# Altium schematic sheet MotorControl_Sch.SchDoc
size B
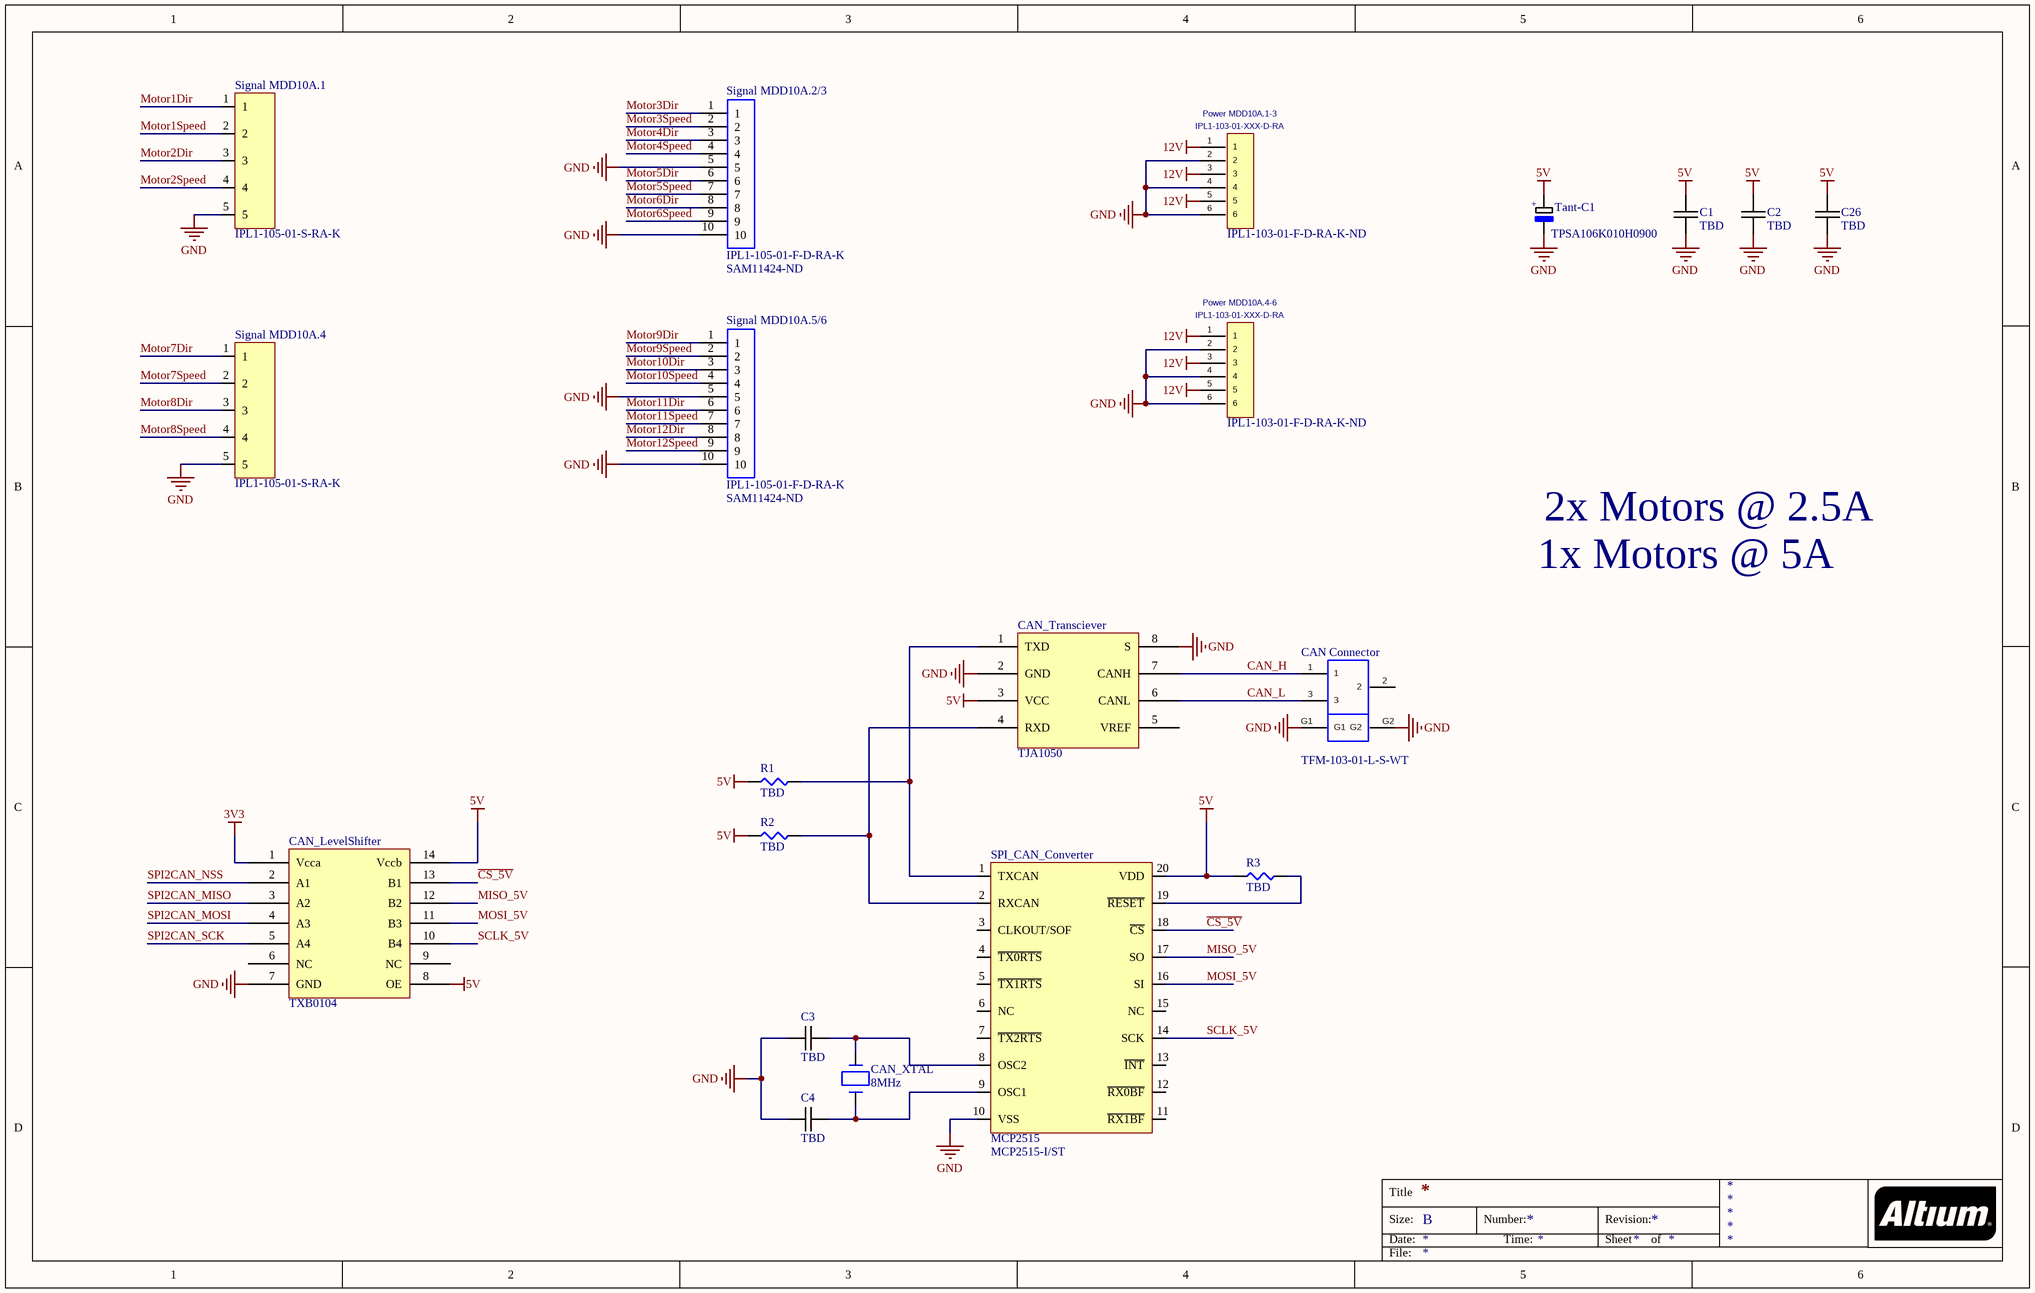
[diagram p0: MotorControl_Sch.SchDoc]

## Parts
C1  TBD  [0805C-GENERIC]
C2  TBD  [0805C-GENERIC]
C3  TBD  [0805C-GENERIC]
C4  TBD  [0805C-GENERIC]
C26  TBD  [0805C-GENERIC]
CAN_Connector  TFM-103-01-L-S-WT  [TFM-103-01-L-S-WT]
CAN_LevelShifter  TXB0104  [TXB0104]
CAN_Transciever  TJA1050  [TJA1050]
CAN_XTAL  8MHz  [GC0800044]
Power_MDD10A.1-3  IPL1-103-01-XXX-D-RA  Supplier Part Number 1: IPL1-103-01-F-D-RA-K-ND  [IPL1-103-01-XXX-D-RA]
Power_MDD10A.4-6  IPL1-103-01-XXX-D-RA  Supplier Part Number 1: IPL1-103-01-F-D-RA-K-ND  [IPL1-103-01-XXX-D-RA]
R1  TBD  [0805R-GENERIC]
R2  TBD  [0805R-GENERIC]
R3  TBD  [0805R-GENERIC]
Signal_MDD10A.1  IPL1-105-01-S-RA-K  [IPL1-105-01-S-RA-K]
Signal_MDD10A.2/3  IPL1-105-01-F-D-RA-K  Supplier Part Number 1: SAM11424-ND  [IPL1-105-01-F-D-RA-K]
Signal_MDD10A.4  IPL1-105-01-S-RA-K  [IPL1-105-01-S-RA-K]
Signal_MDD10A.5/6  IPL1-105-01-F-D-RA-K  Supplier Part Number 1: SAM11424-ND  [IPL1-105-01-F-D-RA-K]
SPI_CAN_Converter  MCP2515  Supplier Part Number 1: MCP2515-I/ST  [TSSOP20]
Tant-C1  TPSA106K010H0900  [TPSA106K010H0900]

## Nets
3V3: CAN_LevelShifter.1(Vcca)
5V: C1.1 C2.1 C26.1 CAN_LevelShifter.8(OE) CAN_LevelShifter.14(Vccb) CAN_Transciever.3(VCC) R1.1 R2.1 R3.1 SPI_CAN_Converter.20(VDD) Tant-C1.1(POS)
12V: Power_MDD10A.1-3.1 Power_MDD10A.1-3.3 Power_MDD10A.1-3.5 Power_MDD10A.4-6.1 Power_MDD10A.4-6.3 Power_MDD10A.4-6.5
GND: C1.2 C2.2 C3.1 C4.1 C26.2 CAN_Connector.G1 CAN_Connector.G2 CAN_LevelShifter.7(GND) CAN_Transciever.2(GND) CAN_Transciever.8(S) Power_MDD10A.1-3.2 Power_MDD10A.1-3.4 Power_MDD10A.1-3.6 Power_MDD10A.4-6.2 Power_MDD10A.4-6.4 Power_MDD10A.4-6.6 Signal_MDD10A.1.5 Signal_MDD10A.2/3.5 Signal_MDD10A.2/3.10 Signal_MDD10A.4.5 Signal_MDD10A.5/6.5 Signal_MDD10A.5/6.10 SPI_CAN_Converter.10(VSS) Tant-C1.2(NEG)
~{CS_5V}: CAN_LevelShifter.13(B1) SPI_CAN_Converter.18(~{CS})
CAN_H: CAN_Connector.1 CAN_Transciever.7(CANH)
CAN_L: CAN_Connector.3 CAN_Transciever.6(CANL)
MISO_5V: CAN_LevelShifter.12(B2) SPI_CAN_Converter.17(SO)
MOSI_5V: CAN_LevelShifter.11(B3) SPI_CAN_Converter.16(SI)
Motor1Dir: Signal_MDD10A.1.1
Motor1Speed: Signal_MDD10A.1.2
Motor2Dir: Signal_MDD10A.1.3
Motor2Speed: Signal_MDD10A.1.4
Motor3Dir: Signal_MDD10A.2/3.1
Motor3Speed: Signal_MDD10A.2/3.2
Motor4Dir: Signal_MDD10A.2/3.3
Motor4Speed: Signal_MDD10A.2/3.4
Motor5Dir: Signal_MDD10A.2/3.6
Motor5Speed: Signal_MDD10A.2/3.7
Motor6Dir: Signal_MDD10A.2/3.8
Motor6Speed: Signal_MDD10A.2/3.9
Motor7Dir: Signal_MDD10A.4.1
Motor7Speed: Signal_MDD10A.4.2
Motor8Dir: Signal_MDD10A.4.3
Motor8Speed: Signal_MDD10A.4.4
Motor9Dir: Signal_MDD10A.5/6.1
Motor9Speed: Signal_MDD10A.5/6.2
Motor10Dir: Signal_MDD10A.5/6.3
Motor10Speed: Signal_MDD10A.5/6.4
Motor11Dir: Signal_MDD10A.5/6.6
Motor11Speed: Signal_MDD10A.5/6.7
Motor12Dir: Signal_MDD10A.5/6.8
Motor12Speed: Signal_MDD10A.5/6.9
SCLK_5V: CAN_LevelShifter.10(B4) SPI_CAN_Converter.14(SCK)
SPI2CAN_MISO: CAN_LevelShifter.3(A2)
SPI2CAN_MOSI: CAN_LevelShifter.4(A3)
SPI2CAN_NSS: CAN_LevelShifter.2(A1)
SPI2CAN_SCK: CAN_LevelShifter.5(A4)
NetC3_2: C3.2 CAN_XTAL.1 SPI_CAN_Converter.8(OSC2)
NetC4_2: C4.2 CAN_XTAL.2 SPI_CAN_Converter.9(OSC1)
NetCAN_Transciever_1: CAN_Transciever.1(TXD) R1.2 SPI_CAN_Converter.1(TXCAN)
NetCAN_Transciever_4: CAN_Transciever.4(RXD) R2.2 SPI_CAN_Converter.2(RXCAN)
NetR3_2: R3.2 SPI_CAN_Converter.19(~{RESET})

Not connected (* = marked no-connect by the designer): CAN_Connector 2; CAN_LevelShifter 6(NC) 9(NC); CAN_Transciever 5(VREF); SPI_CAN_Converter 3(CLKOUT/SOF) 4(~{TX0RTS}) 5(~{TX1RTS}) 6(NC) 7(~{TX2RTS}) 11(~{RX1BF}) 12(~{RX0BF}) 13(~{INT}) 15(NC)

## Notes on the sheet
- 2x Motors @ 2.5A
- 1x Motors @ 5A
- Title
- Size:
- Date:
- B
- Number:
- Time:
- Revision:
- Sheet
- of
- File:
- (in symbol TPSA106K010H0900) +

## Library data of the parts
C1-C4 C26 = 0805C-TBD: CAPACITOR 0805 CERAMIC VALUE TO BE DETERMINED
CAN_XTAL = GC0800044: Diodes Incorporated GC0800044; Supplier 1: Digi-Key; Supplier Part Number 1: GC0800044TR-ND
Power_MDD10A.1-3 Power_MDD10A.4-6 = IPL1-103-01-XXX-D-RA: Terminal Assembly, Double Row, Right Angle, Thru-Hole, 0.100" x 0.100" Pitch, 6Pins; MANUFACTURER: SAMTEC; CREATED: July 16, 2014 - Wendy Xin; PCB DECAL: IPL1-103-01-XXX-D-RA; Supplier 1: Digi-Key
R1-R3 = 0805R-TBD: RESISTOR 0805 VALUE TO BE DETERMINED
Signal_MDD10A.2/3 Signal_MDD10A.5/6 = IPL1-105-01-F-D-RA-K: Supplier 1: Digi-Key
SPI_CAN_Converter = MCP2515: Supplier 1: Arrow